# Altium schematic sheet Interfaces.SchDoc: Interfaces
size A4; Date: 6.4.2015; Engineer: Matjaž Tome; DocumentNumber: 7; Revision: B; SheetNumber: 5; SheetTotal: 10; Project: USB DAQ
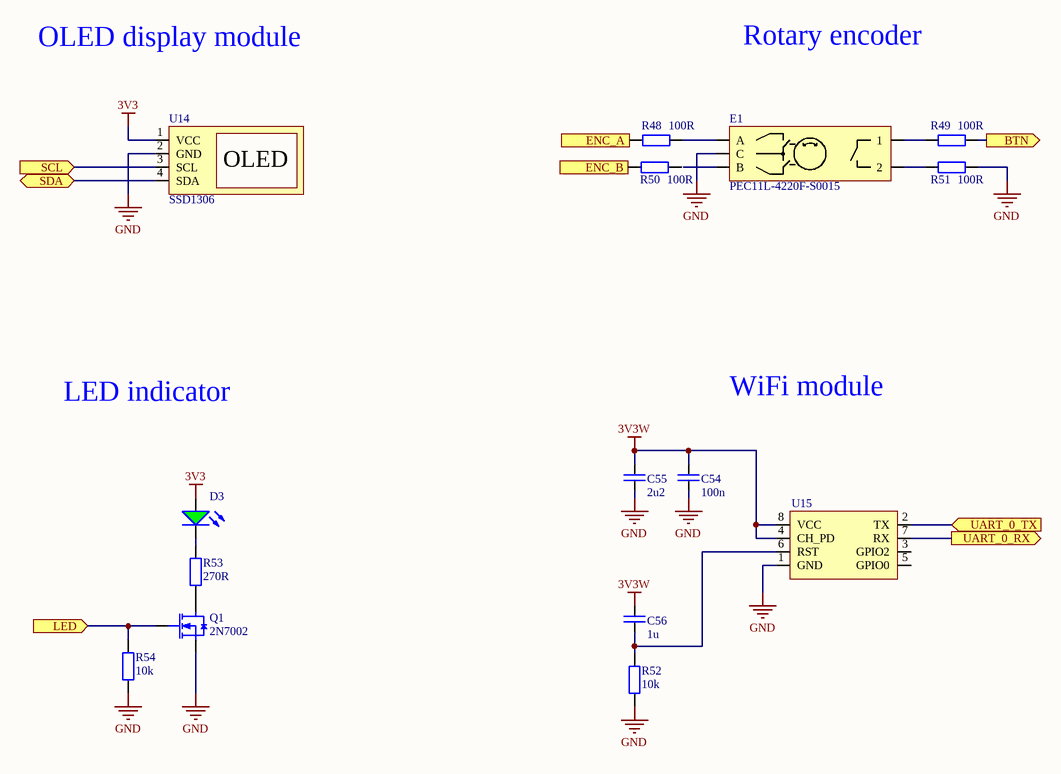
[diagram p0: Interfaces.SchDoc]

## Parts
C54  100n  [C_0603]
C55  2u2  [C_0603]
C56  1u  [C_0603]
D3  LED Green  [LED_0603]  (value not drawn)
E1  PEC11L-4220F-S0015  [PEC11L]
Q1  2N7002  [SOT23-3]
R48  100R  [R_0603]
R49  100R  [R_0603]
R50  100R  [R_0603]
R51  100R  [R_0603]
R52  10k  [R_0603]
R53  270R  [R_0603]
R54  10k  [R_0603]
U14  SSD1306  [OLED1]
U15  ESP-01  [ESP-01]  (value not drawn)

## Ports
BTN (out), ENC_A (out), ENC_B (out), LED (in), SCL (in), SDA (bidir), UART_0_RX (out), UART_0_TX (in)

## Nets
3V3: D3.2(+) U14.1(VCC)
3V3W: C54.2 C55.2 C56.2 U15.4(CH_PD) U15.8(VCC)
GND: C54.1 C55.1 E1.C Q1.2(S) R51.2 R52.1 R54.1 U14.2(GND) U15.1(GND)
BTN: R49.2 ; port BTN
ENC_A: R48.1 ; port ENC_A
ENC_B: R50.1 ; port ENC_B
LED: Q1.1(G) R54.2 ; port LED
SCL: U14.3(SCL) ; port SCL
SDA: U14.4(SDA) ; port SDA
UART_0_RX: U15.7(RX) ; port UART_0_RX
UART_0_TX: U15.2(TX) ; port UART_0_TX
NetC56_1: C56.1 R52.2 U15.6(RST)
NetD3_1: D3.1(-) R53.2
NetE1_1: E1.1 R49.1
NetE1_2: E1.2 R51.1
NetE1_A: E1.A R48.2
NetQ1_3: Q1.3(D) R53.1

Not connected (* = marked no-connect by the designer): E1 B; R50 2; U15 3(GPIO2) 5(GPIO0)

## Notes on the sheet
- Rotary encoder
- OLED display module
- LED indicator
- WiFi module
- Title
- Date
- Project
- Rev
- Engineer
- Sheet
- of
- (in symbol OLED_SSD1306) OLED

## Library data of the parts
C54-C56 = Capacitor: Generic capacitor
  C54: Value: 100n
  C55: Value: 2u2
  C56: Value: 1u
D3 = LED Green: Generic LED Green
E1 = PEC11L-4220F-S0015: Low Profile Encoder 15 PPR 2 Bit Quadrature 5VDC at 10 mA IP40 PCB Mount; Manufacturer: BOURNS; Dealer number: 652-PEC11L4220FS0015; Dealer: Mouser; Category: Rotary encoders; Price: 1.51; Technology: SMT; Manufacturer Number: PEC11L-4220F-S0015; HelpURL: https://www.farnell.com/datasheets/2259386.pdf
Q1 = 2N7002: 60V 0.3A N-channel MOSFET; Part Number: XMN0002; Manufacturer: NXP; Dealer number: 1510761; Dealer: Farnell; RDS: 2.8Ω; Max power disipation: 830mW; Type: N-enhancment mode; Logic level: Yes; Category: mosfets; Price: 0.039; Manufacturer Number: 2N7002; Max voltage: 60V; Max current: 0.3A; Case: SOT23-3; Technology: SMT; HelpURL: https://www.farnell.com/datasheets/1499179.pdf; SKU: 5000000000001
R48-R54 = Resistor: Generic resistor
  R48-R51: Value: 100R
  R52 R54: Value: 10k
  R53: Value: 270R
U14 = OLED_SSD1306: Oled display module; Part Number: OLM0000; Dealer: Ebay; Category: Displays; Price: 7; Technology: THT; HelpURL: https://cdn-shop.adafruit.com/datasheets/SSD1306.pdf
U15 = ESP-01: WIFI module; Part Number: XWM0000; Dealer: Ebay; Category: WIFI modules; Price: 3.8; Technology: THT; HelpURL: https://en.wikipedia.org/wiki/ESP8266